# Altium schematic sheet ETH_on_RS485_Node_Example_TOP.SchDoc: ETH_on_RS485_Node_Example
size A3; Author: Nico Korn; CompanyName: R&M; DrawnBy: Nico Korn; Engineer: Nico Korn; Organization: Reichle & De-Massari; Address1: Binzstrasse 32; Address2: 8620 Wetzikon; Address3: Switzerland; DocumentNumber: 1; Revision: V1.0; SheetNumber: 1; SheetTotal: 7; Description1: Beschreibung; Size: A3; ShortDescription: Übersicht
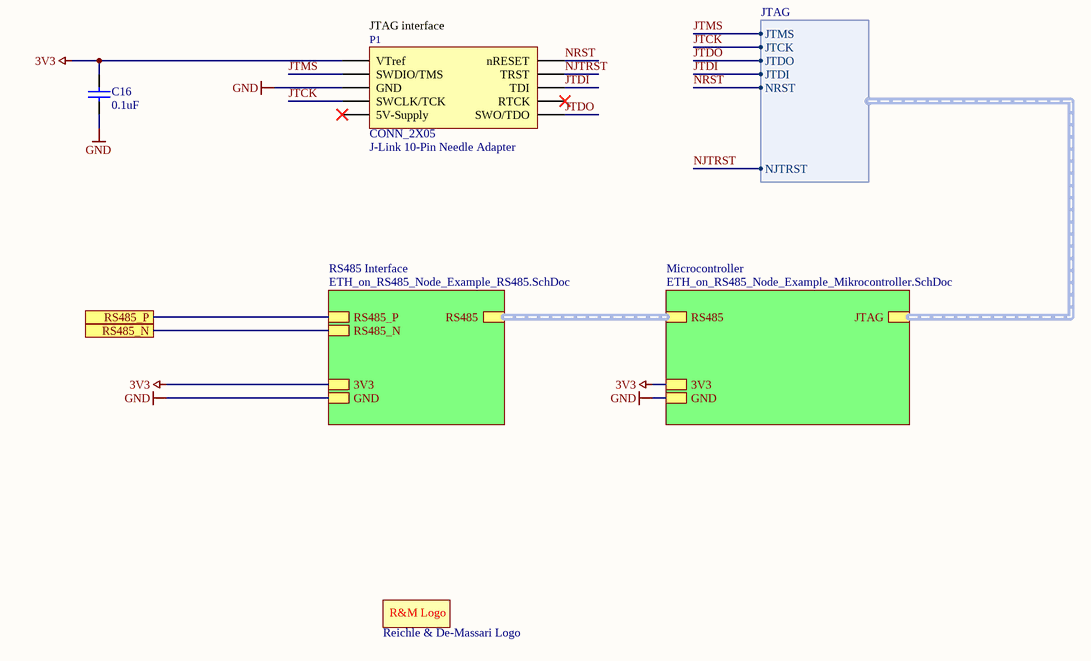
[diagram p0: ETH_on_RS485_Node_Example_TOP.SchDoc]

## Parts
1  Reichle & De-Massari Logo  [SYMBOL_R&M]  (no BOM)
C16  0.1uF  [Ceramic Capacitor 0402 EIA]
P1  CONN_2X05  [CONN_2X05_SEGGER]  (no BOM)

## Sub-sheets
Microcontroller = ETH_on_RS485_Node_Example_Mikrocontroller.SchDoc: RS485 (harness RS485), 3V3, GND, JTAG (harness JTAG)
RS485 Interface = ETH_on_RS485_Node_Example_RS485.SchDoc: 3V3, RS485_P, RS485_N, GND, RS485 (harness RS485)

## Ports
RS485_N, RS485_P

## Harnesses
JTAG: JTMS, JTCK, JTDI, JTDO, NRST, NJTRST

## Nets
3V3: C16.2 P1.1(VTref) ; sheet RS485 Interface/3V3, sheet Microcontroller/3V3
GND: C16.1 P1.3(GND) ; sheet RS485 Interface/GND, sheet Microcontroller/GND
JTCK: P1.4(SWCLK/TCK) ; sheet Microcontroller/JTAG.JTCK
JTDI: P1.8(TDI) ; sheet Microcontroller/JTAG.JTDI
JTDO: P1.6(SWO/TDO) ; sheet Microcontroller/JTAG.JTDO
JTMS: P1.2(SWDIO/TMS) ; sheet Microcontroller/JTAG.JTMS
NJTRST: P1.9(TRST) ; sheet Microcontroller/JTAG.NJTRST
NRST: P1.10(nRESET) ; sheet Microcontroller/JTAG.NRST
RS485_N: port RS485_N, sheet RS485 Interface/RS485_N
RS485_P: port RS485_P, sheet RS485 Interface/RS485_P

Not connected (* = marked no-connect by the designer): P1 5(5V-Supply)* 7(RTCK)*

## Buses and harness runs
harness sheet Microcontroller/RS485 = sheet RS485 Interface/RS485

## Notes on the sheet
- (near P1) JTAG interface
- Title
- Size:
- Date:
- A3
- Number:
- Time:
- Revision:
- Sheet
- of
- File:
- (in symbol SYMBOL_R&M) R&M Logo

## Library data of the parts
1 = SYMBOL_R&M: Replaceable: no; Footprint/Package: 2.54mm
C16 = Cap_0.1uF_0402: SMD/SMT WCAP-CSGP 0.1uF 0402 20% 10V MLCC; Manufacturer: Wurth Electronics; Manufacturer PartNr: 885012105010; voltage: 10VDC; Dielectric Grade: X5R; Replaceable: yes; value: 0.1uF; tolerance: 20%; ComponentLink1Description: mouser; ComponentLink1URL: https://www.mouser.ch/ProductDetail/Wurth-Electronics/885012105010?qs=sGAEpiMZZMs0AnBnWHyRQEGbLOF2VP1ihL84oCjXnlO407YOHi%2fQbw%3d%3d; Footprint/Package: 0402; Supplier 1: Mouser; Supplier 2: Farnell; Supplier Part Number 1: 710-885012105010; Supplier Part Number 2: 2533928; Supplier 3: Digi-Key; Supplier Part Number 3: 732-7487-1-ND
P1 = CONN_2X05_SEGGER: J-Link 10-Pin Needle Adapter; Manufacturer: Samtec; Replaceable: no; Footprint/Package: 1.27 mm; Manufacturer PartNr: J-Link 10-Pin Needle Adapter